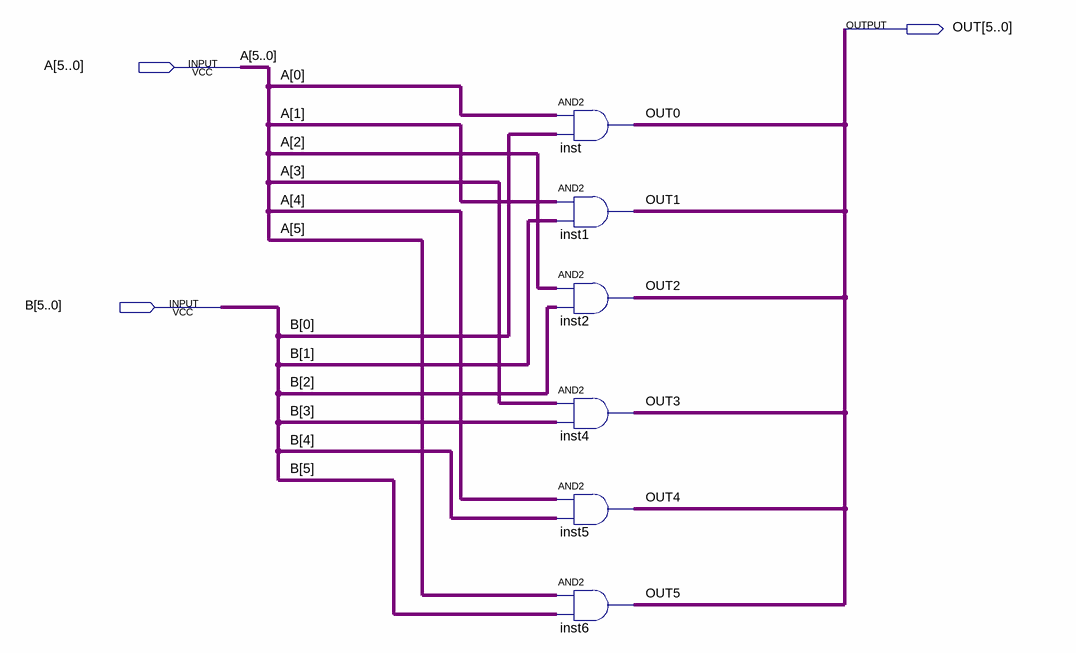
[diagram p0: schematic sheet]
// Quartus schematic opAND.bdf as structural Verilog: 6 symbols, 3 pins
module opAND (
  input  [5:0] A,
  input  [5:0] B,
  output [5:0] OUT
);

  and inst (OUT[0], A[0], B[0]);
  and inst1 (OUT[1], A[1], B[1]);
  and inst2 (OUT[2], A[2], B[2]);
  and inst4 (OUT[3], A[3], B[3]);
  and inst5 (OUT[4], A[4], B[4]);
  and inst6 (OUT[5], A[5], B[5]);
endmodule
